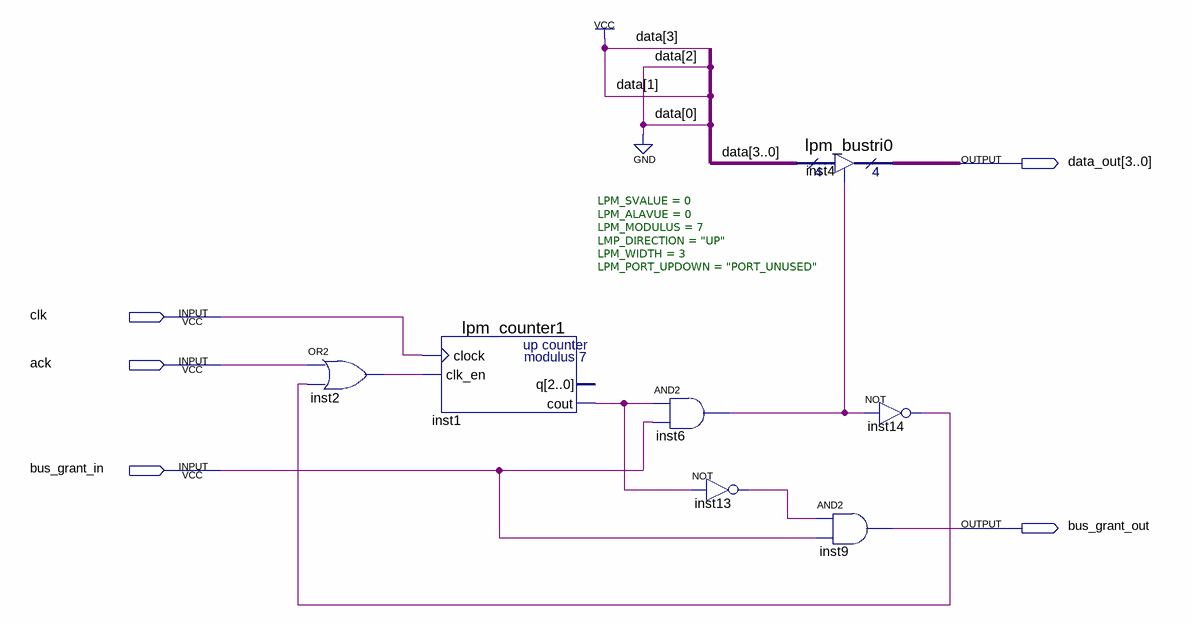
[diagram p0: schematic sheet]
// Quartus schematic master_block_1.bdf as structural Verilog: 7 symbols, 5 pins
module master_block_1 (
  input  clk,
  input  ack,
  input  bus_grant_in,
  output [3:0] data_out,
  output bus_grant_out
);

  wire inst1_cout, inst2_out, inst6_out, inst13_out, inst14_out;

  or inst2 (inst2_out, ack, inst14_out);
  lpm_counter1 #(.LPM_SVALUE(0), .LPM_ALAVUE(0), .LPM_MODULUS(7), .LMP_DIRECTION("UP"), .LPM_WIDTH(3), .LPM_PORT_UPDOWN("PORT_UNUSED")) inst1 (
    .clock(clk), .clk_en(inst2_out), .cout(inst1_cout));  // open: q
  and inst6 (inst6_out, inst1_cout, bus_grant_in);
  not inst13 (inst13_out, inst1_cout);
  lpm_bustri0 inst4 (.enabledt(inst6_out), .data(4'b1010), .tridata(data_out));
  not inst14 (inst14_out, inst6_out);
  and inst9 (bus_grant_out, inst13_out, bus_grant_in);
endmodule
